# Altium schematic sheet Control_Module_ETH_V1.SchDoc: Módulo de Control - Ethernet
size A4; Author: Martin C.A. Yunis; CompanyName: Sistema de Control de Acceso; Revision: V1; SheetNumber: 1; SheetTotal: 1
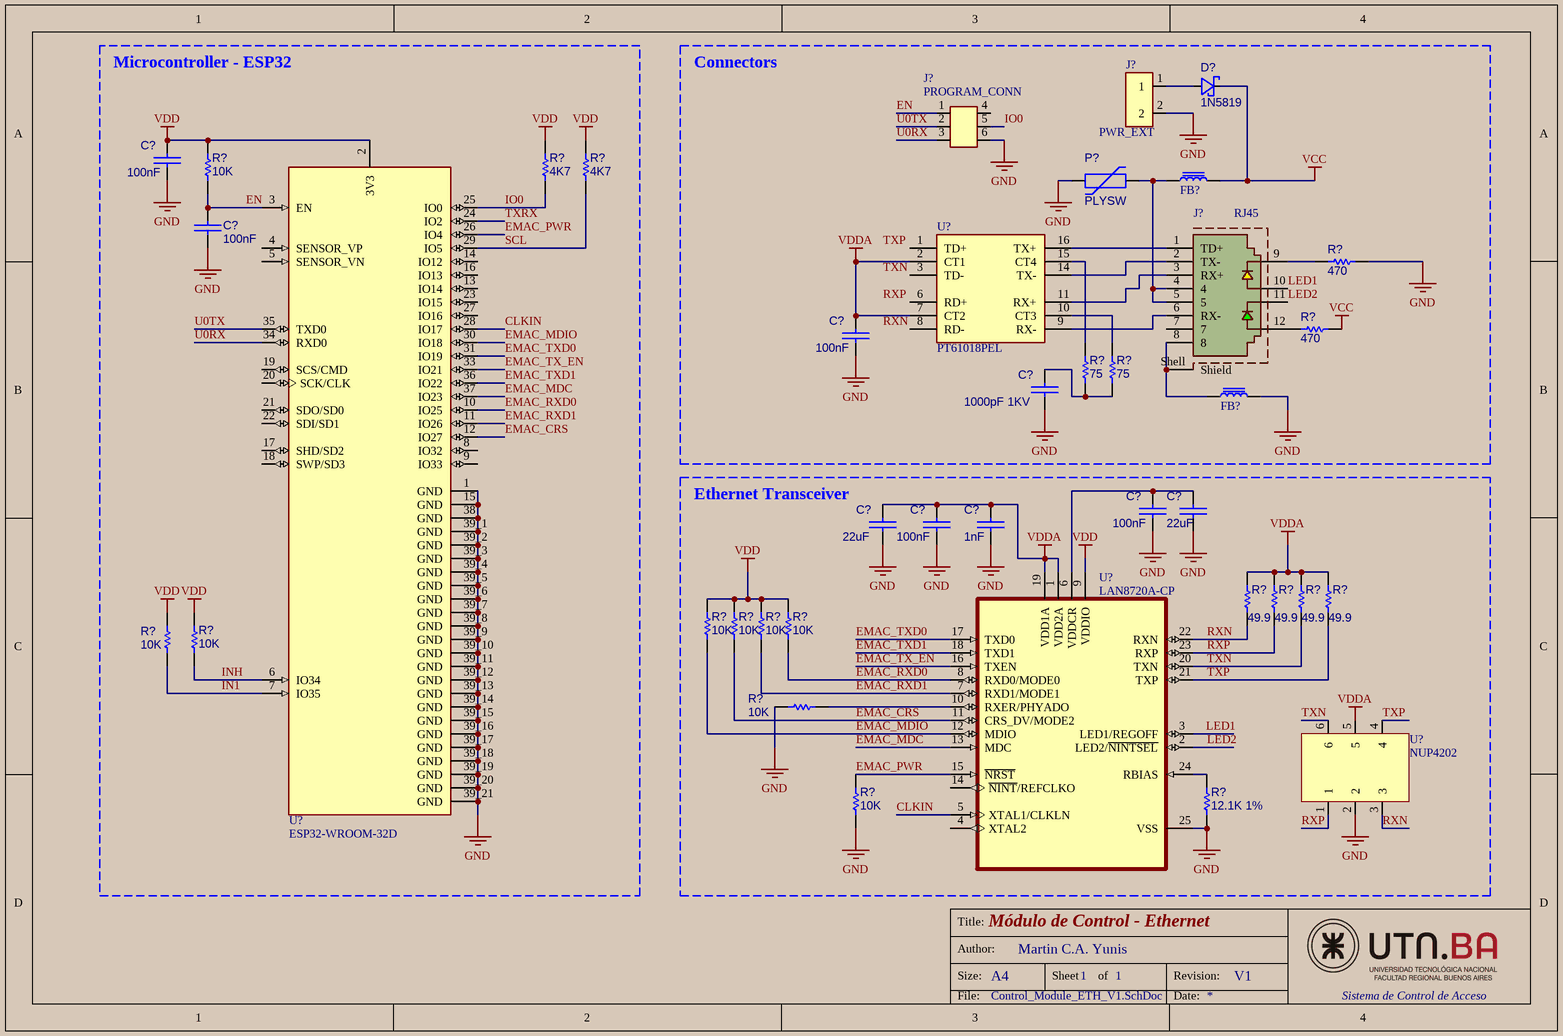
[diagram p0: Control_Module_ETH_V1.SchDoc]

## Parts
(Parts that share a designator on the sheet are numbered #1, #2 ... from top to bottom, then left to right.)
C?#1  100nF
C?#2  100nF
C?#3  100nF
C?#4  1000pF 1KV
C?#5  100nF
C?#6  22uF
C?#7  22uF
C?#8  100nF
C?#9  1nF
D?  1N5819
FB?#1  Choke  (value not drawn)
FB?#2  Choke  (value not drawn)
J?#1  PWR_EXT
J?#2  PROGRAM_CONN
J?#3  RJ45  [CUI_CRJ061-L1-TH]
P?  PLYSW
R?#1  10K
R?#2  4K7
R?#3  4K7
R?#4  470
R?#5  470
R?#6  75
R?#7  75
R?#8  49.9
R?#9  49.9
R?#10  49.9
R?#11  49.9
R?#12  10K
R?#13  10K
R?#14  10K
R?#15  10K
R?#16  10K
R?#17  10K
R?#18  10K
R?#19  10K
R?#20  12.1K 1%
U?#1  PT61018PEL  [XFMR_PT61018PEL]
U?#2  ESP32-WROOM-32D  [MODULE_ESP32-WROOM-32D]
U?#3  LAN8720A-CP  [QFN50P400X400X100-25N]
U?#4  NUP4202

## Blocks framed on the sheet
Microcontroller - ESP32: C?#1 C?#2 R?#1-R?#3 R?#16 R?#17 U?#2
Connectors: C?#3 C?#4 D? FB?#1 FB?#2 J?#1-J?#3 P? R?#4-R?#7 U?#1
Ethernet Transceiver: C?#5-C?#9 R?#8-R?#15 R?#18-R?#20 U?#3 U?#4

## Nets
GND: C?#1.2 C?#2.2 C?#3.2 C?#4.2 C?#5.2 C?#6.2 C?#7.2 C?#8.2 C?#9.2 FB?#2.2 J?#1.2 J?#2.6 P?.2 R?#4.2 R?#18.2 R?#19.2 R?#20.2 U?#2.1(GND) U?#2.15(GND) U?#2.38(GND) U?#2.39_1(GND) U?#2.39_2(GND) U?#2.39_3(GND) U?#2.39_4(GND) U?#2.39_5(GND) U?#2.39_6(GND) U?#2.39_7(GND) U?#2.39_8(GND) U?#2.39_9(GND) U?#2.39_10(GND) U?#2.39_11(GND) U?#2.39_12(GND) U?#2.39_13(GND) U?#2.39_14(GND) U?#2.39_15(GND) U?#2.39_16(GND) U?#2.39_17(GND) U?#2.39_18(GND) U?#2.39_19(GND) U?#2.39_20(GND) U?#2.39_21(GND) U?#3.25(VSS) U?#4.2
VCC: D?.2(K) FB?#1.2 R?#5.2
VDD: C?#1.1 R?#1.2 R?#2.2 R?#3.2 R?#12.2 R?#13.2 R?#14.2 R?#15.2 R?#16.2 R?#17.2 U?#2.2(3V3) U?#3.9(VDDIO)
VDDA: C?#3.1 C?#7.1 C?#8.1 C?#9.1 R?#8.2 R?#9.2 R?#10.2 R?#11.2 U?#1.2(CT1) U?#1.7(CT2) U?#3.1(VDD2A) U?#3.19(VDD1A) U?#4.5
CLKIN: U?#2.28(IO17) U?#3.5(XTAL1/CLKLN)
EMAC_CRS: R?#13.1 U?#2.12(IO27) U?#3.11(CRS_DV/MODE2)
EMAC_MDC: U?#2.37(IO23) U?#3.13(MDC)
EMAC_MDIO: R?#12.1 U?#2.30(IO18) U?#3.12(MDIO)
EMAC_PWR: R?#19.1 U?#2.26(IO4) U?#3.15(~{NRST})
EMAC_RXD0: R?#15.1 U?#2.10(IO25) U?#3.8(RXD0/MODE0)
EMAC_RXD1: R?#14.1 U?#2.11(IO26) U?#3.7(RXD1/MODE1)
EMAC_TX_EN: U?#2.33(IO21) U?#3.16(TXEN)
EMAC_TXD0: U?#2.31(IO19) U?#3.17(TXD0)
EMAC_TXD1: U?#2.36(IO22) U?#3.18(TXD1)
EN: C?#2.1 J?#2.1 R?#1.1 U?#2.3(EN)
IN1: R?#16.1 U?#2.7(IO35)
INH: R?#17.1 U?#2.6(IO34)
IO0: J?#2.5 R?#2.1 U?#2.25(IO0)
LED1: J?#3.10 U?#3.3(LED1/REGOFF)
LED2: J?#3.11 U?#3.2(LED2/~{NINTSEL})
RXN: R?#8.1 U?#3.22(RXN) U?#4.3
RXP: R?#9.1 U?#3.23(RXP) U?#4.1
SCL: R?#3.1 U?#2.29(IO5)
TXN: R?#10.1 U?#3.20(TXN) U?#4.6
TXP: R?#11.1 U?#3.21(TXP) U?#4.4
TXRX: U?#2.24(IO2)
U0RX: J?#2.3 U?#2.34(RXD0)
U0TX: J?#2.2 U?#2.35(TXD0)
NetC?#4_1: C?#4.1 R?#6.2 R?#7.2
NetC?#5_1: C?#5.1 C?#6.1 U?#3.6(VDDCR)
NetD?_1: D?.1(A) J?#1.1
NetFB?#1_1: FB?#1.1 J?#3.4 J?#3.5 P?.1
NetFB?#2_1: FB?#2.1 J?#3.8 J?#3.Shell(Shield)
NetJ?#3_1: J?#3.1(TD+) U?#1.16(TX+)
NetJ?#3_2: J?#3.2(TX-) U?#1.14(TX-)
NetJ?#3_3: J?#3.3(RX+) U?#1.11(RX+)
NetJ?#3_6: J?#3.6(RX-) U?#1.9(RX-)
NetJ?#3_9: J?#3.9 R?#4.1
NetJ?#3_12: J?#3.12 R?#5.1
NetR?#6_1: R?#6.1 U?#1.15(CT4)
NetR?#7_1: R?#7.1 U?#1.10(CT3)
NetR?#18_1: R?#18.1 U?#3.10(RXER/PHYADO)
NetR?#20_1: R?#20.1 U?#3.24(RBIAS)

Not connected (* = marked no-connect by the designer): J?#2 4; J?#3 7; U?#1 1(TD+) 3(TD-) 6(RD+) 8(RD-); U?#2 4(SENSOR_VP) 5(SENSOR_VN) 8(IO32) 9(IO33) 13(IO14) 14(IO12) 16(IO13) 17(SHD/SD2) 18(SWP/SD3) 19(SCS/CMD) 20(SCK/CLK) 21(SDO/SD0) 22(SDI/SD1) 23(IO15) 27(IO16); U?#3 4(XTAL2) 14(~{NINT}/REFCLKO)

## Notes on the sheet
- Labels drawn without touching a wire or pin: RXN, RXP, TXN, TXP
- Title:
- Size:
- Author:
- A4
- Sheet
- of
- Revision:
- File:
- Date:

## Library data of the parts
C?#1-C?#9 = CAP: Non Polarized Capacitor
D? = DIODO_SH: Diode Shottky
FB?#1 FB?#2 = Choke: High Frequency EMI Suppression Ferrite Bead; Manufacturer Part Number: 742863160; Manufacturer: Wurth Elektronik; Match Code: WE-CBF HF; Case/Size Code: 0603; DC Resistance: 0.22Ohm; Impedance @100MHz: 600Ohm; Impedance @1GHz: 800Ohm; Impedance Max: 950Ohm; Impedance Max Test Condition: 600MHz; Rated Current: 0.5A; Type: High Current; Category: Ferrites for PCB Assembly; ComponentLink1Description: Website Link; ComponentLink1URL: https://www.we-online.com/redexpert/article/742863160?ad; ComponentLink2Description: Datasheet Link; ComponentLink2URL: https://www.we-online.com/redexpert/spec/742863160?ad; Mount: Surface Mount; Operating Temperature Max: 125°C; Operating Temperature Min: -55°C; Packaging: Tape and Reel; Length: 1.6mm; Width: 0.8mm; Height: 0.8mm
J?#1 = CONN_2P: 12V EXT Connector
J?#2 = CONN_3X2P: ESP Programming Connector
J?#3 = CRJ061-L1-TH: 8P8C, Single Port, Vertical, Shielded, LED, Through Hole, RJ45 Modular Connector; MF: Same Sky; SnapEDA_Link: https://www.snapeda.com/parts/CRJ061-L1-TH/Same+Sky/view-part/?ref=snap; Package: None; Value: *; MP: CRJ061-L1-TH; Check_prices: https://www.snapeda.com/parts/CRJ061-L1-TH/Same+Sky/view-part/?ref=eda
P? = PLYSW: Polyswitch
R?#1-R?#20 = Res1: Resistor
U?#1 = PT61018PEL: LAN Transformer, 10/100 Base-Tx, OP -40C to +85C, CUT TAPE | Bourns PT61018PEL; SnapEDA_Link: https://www.snapeda.com/parts/PT61018PEL/Bourns/view-part/?ref=snap; Package: SMD-16 Bourns; Value: *; MF: Bourns; MP: PT61018PEL; Check_prices: https://www.snapeda.com/parts/PT61018PEL/Bourns/view-part/?ref=eda
U?#2 = ESP32-WROOM-32D: Bluetooth, WiFi 802.11b/g/n, Bluetooth v4.2 +EDR, Class 1, 2 and 3 Transceiver Module 2.4GHz ~ 2.5GHz Integrated; MF: Espressif Systems; SnapEDA_Link: https://www.snapeda.com/parts/ESP32-WROOM-32D/Espressif+Systems/view-part/?ref=snap; Package: Non Standard Espressif Systems; Value: *; MP: ESP32-WROOM-32D; Check_prices: https://www.snapeda.com/parts/ESP32-WROOM-32D/Espressif+Systems/view-part/?ref=eda
U?#3 = LAN8720A-CP: PHY 1-CH 10Mbps/100Mbps 2.5V/3.3V 24-Pin VQFN EP Tray; MF: Microchip Technology; SnapEDA_Link: https://www.snapeda.com/parts/LAN8720A-CP/Microchip/view-part/?ref=snap; Package: VFQFN-24 Microchip Technology; Value: *; MP: LAN8720A-CP; Check_prices: https://www.snapeda.com/parts/LAN8720A-CP/Microchip/view-part/?ref=eda
U?#4 = NUP4202: 6A 20V 6V Unidirectional 5V SOT-363 ESD and Surge Protection